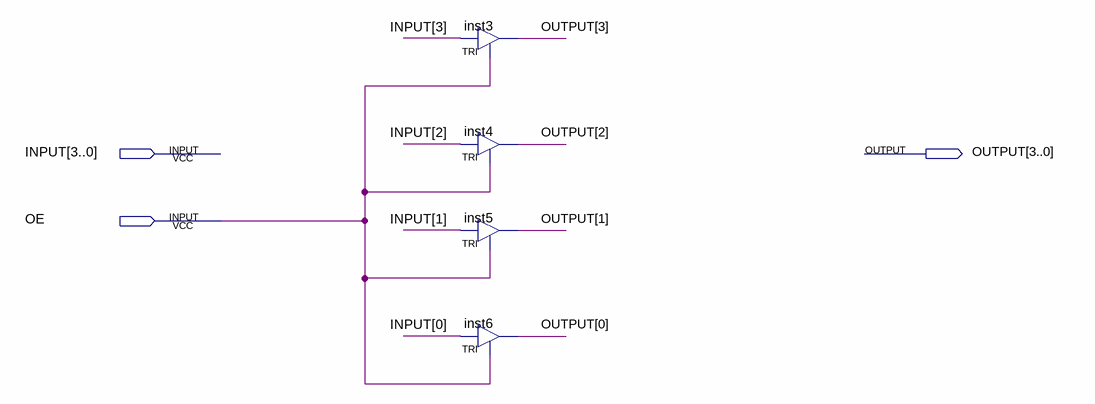
[diagram p0: schematic sheet]
// Quartus schematic Tri4bit.bdf as structural Verilog: 4 symbols, 3 pins
module Tri4bit (
  input  [3:0] INPUT,
  input  OE,
  output [3:0] OUTPUT
);

  TRI inst3 (.IN(INPUT[3]), .OE(OE), .OUT(OUTPUT[3]));
  TRI inst4 (.IN(INPUT[2]), .OE(OE), .OUT(OUTPUT[2]));
  TRI inst5 (.IN(INPUT[1]), .OE(OE), .OUT(OUTPUT[1]));
  TRI inst6 (.IN(INPUT[0]), .OE(OE), .OUT(OUTPUT[0]));
endmodule
